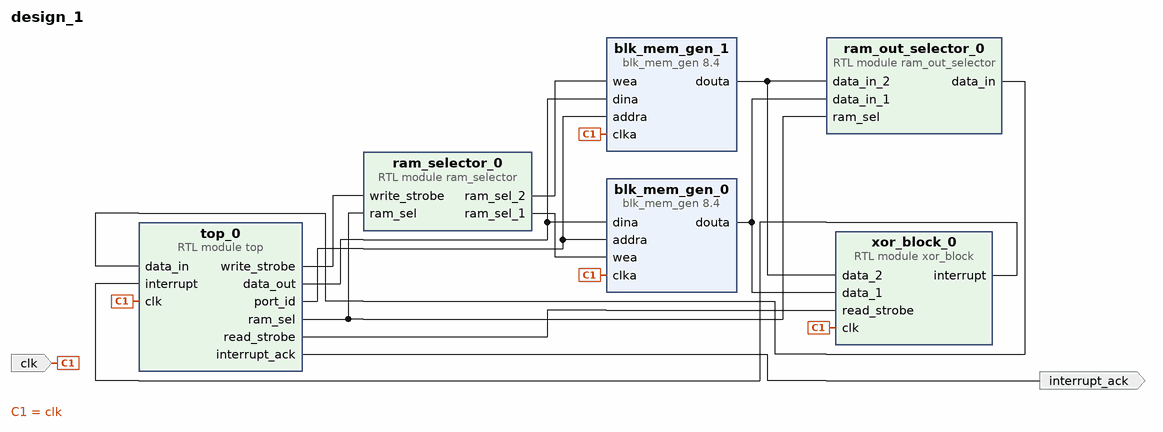
[diagram p0: block diagram of the top level]
# Vivado block design design_1, xc7k70tfbv676-1, Vivado 2021.1
create_bd_design design_1

create_bd_port -dir I -type clk clk
set_property -dict {CONFIG.FREQ_HZ 100000000} [get_bd_ports clk]
create_bd_port -dir O interrupt_ack

create_bd_cell -type ip -vlnv xilinx.com:ip:blk_mem_gen:8.4 blk_mem_gen_0
set_property -dict [list \
  CONFIG.Enable_32bit_Address false \
  CONFIG.Enable_A Always_Enabled \
  CONFIG.Read_Width_A 8 \
  CONFIG.Register_PortA_Output_of_Memory_Primitives true \
  CONFIG.Use_Byte_Write_Enable false \
  CONFIG.Use_RSTA_Pin false \
  CONFIG.Write_Depth_A 128 \
  CONFIG.Write_Width_A 8 \
  CONFIG.use_bram_block Stand_Alone \
] [get_bd_cells blk_mem_gen_0]
create_bd_cell -type ip -vlnv xilinx.com:ip:blk_mem_gen:8.4 blk_mem_gen_1
set_property -dict [list \
  CONFIG.Enable_32bit_Address false \
  CONFIG.Enable_A Always_Enabled \
  CONFIG.Read_Width_A 8 \
  CONFIG.Register_PortA_Output_of_Memory_Primitives true \
  CONFIG.Use_Byte_Write_Enable false \
  CONFIG.Use_RSTA_Pin false \
  CONFIG.Write_Depth_A 128 \
  CONFIG.Write_Width_A 8 \
  CONFIG.use_bram_block Stand_Alone \
] [get_bd_cells blk_mem_gen_1]
create_bd_cell -type module -reference top top_0
create_bd_cell -type module -reference xor_block xor_block_0
create_bd_cell -type module -reference ram_out_selector ram_out_selector_0
create_bd_cell -type module -reference ram_selector ram_selector_0

# ---- connections ----

connect_bd_net [get_bd_pins blk_mem_gen_0/douta] [get_bd_pins xor_block_0/data_1] [get_bd_pins ram_out_selector_0/data_in_1]
connect_bd_net [get_bd_pins blk_mem_gen_1/douta] [get_bd_pins xor_block_0/data_2] [get_bd_pins ram_out_selector_0/data_in_2]
connect_bd_net [get_bd_ports clk] \
  [get_bd_pins blk_mem_gen_1/clka] [get_bd_pins blk_mem_gen_0/clka] [get_bd_pins top_0/clk] [get_bd_pins xor_block_0/clk]
connect_bd_net [get_bd_pins ram_out_selector_0/data_in] [get_bd_pins top_0/data_in]
connect_bd_net [get_bd_pins ram_selector_0/ram_sel_1] [get_bd_pins blk_mem_gen_0/wea]
connect_bd_net [get_bd_pins ram_selector_0/ram_sel_2] [get_bd_pins blk_mem_gen_1/wea]
connect_bd_net [get_bd_pins top_0/data_out] [get_bd_pins blk_mem_gen_1/dina] [get_bd_pins blk_mem_gen_0/dina]
connect_bd_net [get_bd_pins top_0/interrupt_ack] [get_bd_ports interrupt_ack]
connect_bd_net [get_bd_pins top_0/port_id] [get_bd_pins blk_mem_gen_1/addra] [get_bd_pins blk_mem_gen_0/addra]
connect_bd_net [get_bd_pins top_0/ram_sel] [get_bd_pins ram_out_selector_0/ram_sel] [get_bd_pins ram_selector_0/ram_sel]
connect_bd_net [get_bd_pins top_0/read_strobe] [get_bd_pins xor_block_0/read_strobe]
connect_bd_net [get_bd_pins top_0/write_strobe] [get_bd_pins ram_selector_0/write_strobe]
connect_bd_net [get_bd_pins xor_block_0/interrupt] [get_bd_pins top_0/interrupt]

validate_bd_design
save_bd_design
